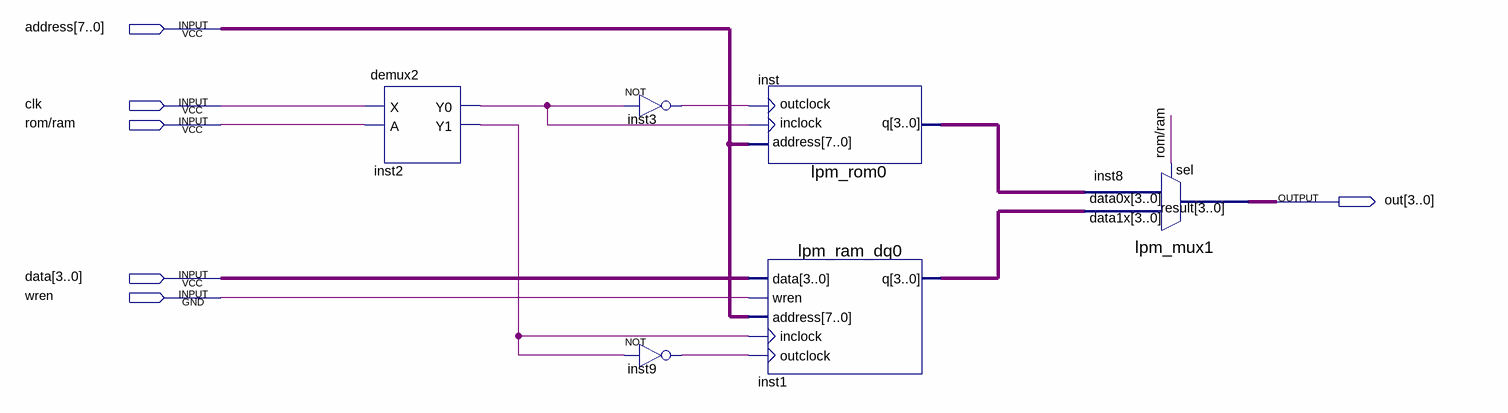
[diagram p0: schematic sheet]
// Quartus schematic memory.bdf as structural Verilog: 6 symbols, 6 pins
module memory (
  input  [7:0] address,
  input  clk,
  input  \rom/ram ,
  input  [3:0] data,
  input  wren,
  output [3:0] out
);

  wire inst2_y0, inst2_y1, inst3_out, inst9_out;
  wire [3:0] inst1_q, inst_q;

  demux2 inst2 (.X(clk), .A(\rom/ram ), .Y0(inst2_y0), .Y1(inst2_y1));
  not inst3 (inst3_out, inst2_y0);
  not inst9 (inst9_out, inst2_y1);
  lpm_rom0 inst (.address(address), .inclock(inst2_y0), .outclock(inst3_out), .q(inst_q));
  lpm_ram_dq0 inst1 (
    .data(data), .wren(wren), .address(address), .inclock(inst2_y1), .outclock(inst9_out), .q(inst1_q));
  lpm_mux1 inst8 (.data1x(inst1_q), .data0x(inst_q), .sel(\rom/ram ), .result(out));
endmodule
